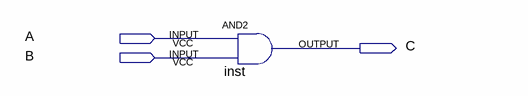
[diagram p0: schematic sheet]
// Quartus schematic proj01.bdf as structural Verilog: 1 symbols, 3 pins
module proj01 (
  input  A,
  input  B,
  output C
);

  and inst (C, A, B);
endmodule
